# EAGLE design rgbw-driver (EAGLE 6.5.0)
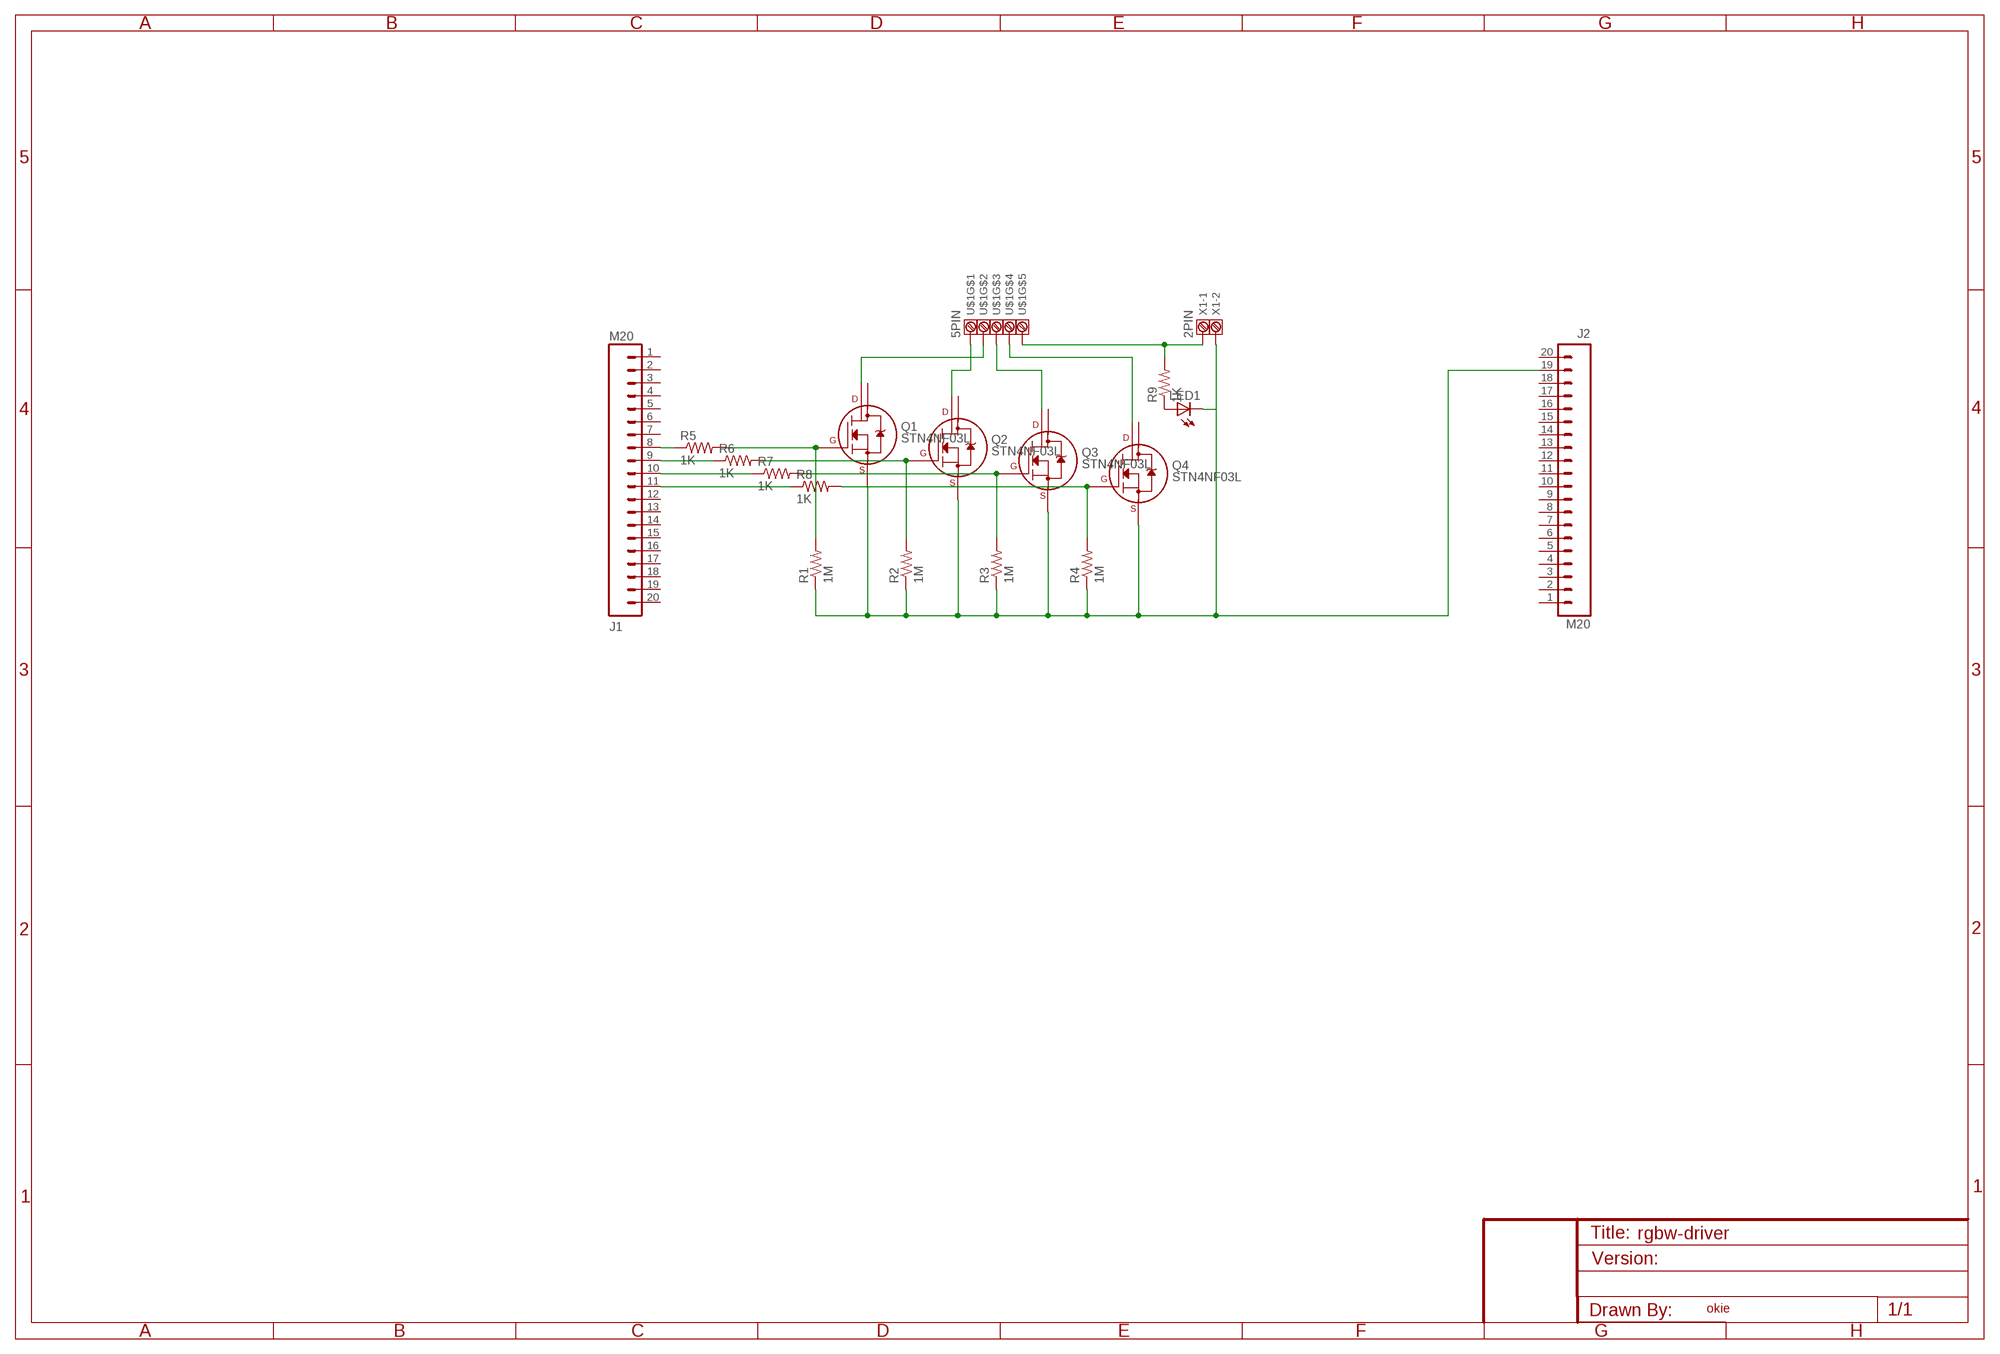
[diagram p0: schematic, sheet 1]

## Parts
J1  M20  [1X20]
J2  M20  [1X20]
LED1  LEDCHIP-LED0805  [CHIP-LED0805]
Q1  STN4NF03L  IRLL014  [SOT-223]
Q2  STN4NF03L  IRLL014  [SOT-223]
Q3  STN4NF03L  IRLL014  [SOT-223]
Q4  STN4NF03L  IRLL014  [SOT-223]
R1  1M  R-US_R0805  [R0805]
R2  1M  R-US_R0805  [R0805]
R3  1M  R-US_R0805  [R0805]
R4  1M  R-US_R0805  [R0805]
R5  1K  R-US_R0805  [R0805]
R6  1K  R-US_R0805  [R0805]
R7  1K  R-US_R0805  [R0805]
R8  1K  R-US_R0805  [R0805]
R9  1K  R-US_R0805  [R0805]
U$1  5PIN  [5PIN]
X1  2PIN  [2PIN]

## Nets
B: Q1.4(D2) U$1.2
G: U$1.4
N$1: J1.8 R5.1
N$2: Q1.1(G) R1.2 R5.2
N$3: LED1.A R9.1
N$4: J2.19 LED1.C Q1.3(S) Q2.3(S) Q3.3(S) Q4.3(S) R1.1 R2.1 R3.1 R4.1 X1.2
N$5: Q4.1(G) R4.2 R8.2
N$6: R9.2 U$1.5 X1.1
N$8: J1.9 R6.1
N$9: J1.10 R7.1
N$10: J1.11 R8.1
N$11: Q2.1(G) R2.2 R6.2
N$12: Q3.1(G) R3.2 R7.2
R: Q3.4(D2) U$1.3
W: Q2.4(D2) U$1.1
Unconnected: J1.1 J1.2 J1.3 J1.4 J1.5 J1.6 J1.7 J1.12 J1.13 J1.14 J1.15 J1.16 J1.17 J1.18 J1.19 J1.20 J2.1 J2.2 J2.3 J2.4 J2.5 J2.6 J2.7 J2.8 J2.9 J2.10 J2.11 J2.12 J2.13 J2.14 J2.15 J2.16 J2.17 J2.18 J2.20 Q1.2(D1) Q2.2(D1) Q3.2(D1) Q4.2(D1) Q4.4(D2)

## Notes on the sheet
- okie

## Library data of the parts
J1 J2 = SparkFun3:M20: This is just like the LOCK variant in that the holes are staggared by 5 mil, but except for the last two holes. They are not altered from the "standard" footprint layout. This is used for a special purpose on the layout of our Graphic LCD Backpack. Make sure you want to use this device before selecting it for you project!
LED1 = adafruit:LED: LED OSRAM: - CHIPLED LG R971, LG N971, LY N971, LG Q971, LY Q971, LO R971, LY R971 LH N974, LH R974 LS Q976, LO Q976, LY Q976 LO Q996 - Hyper CHIPLED LW Q18S LB Q993, LB Q99A, LB R99A - SideLED LS A670, LO A670, LY A670, LG A670, LP A670 LB A673, LV A673, LT A673, LW A673 LH A674 LY A675 LS A676, LA A676, LO A676, LY A676, LW A676 LS A679, LY A679, LG A679 - Hyper Micro SIDELED® LS Y876, LA Y876, LO Y876, LY Y876 LT Y87S - SmartLED LW L88C, LW L88S LB L89C, LB L89S, LG L890 LS L89K, LO L89K, LY L89K LS L896, LA L896, LO L896, LY L896 - TOPLED LS T670, LO T670, LY T670, LG T670, LP T670 LSG T670, LSP T670, LSY T670, LOP T670, LYG T670 LG T671, LOG T671, LSG T671 LB T673, LV T673, LT T673, LW T673 LH T674 LS T676, LA T676, LO T676, LY T676, LB T676, LH T676, LSB T676, LW T676 LB T67C, LV T67C, LT T67C, LS T67K, LO T67K, LY T67K, LW E67C LS E67B, LA E67B, LO E67B, LY E67B, LB E67C, LV E67C, LT E67C LW T67C LS T679, LY T679, LG T679 LS T770, LO T770, LY T770, LG T770, LP T770 LB T773, LV T773, LT T773, LW T773 LH T774 LS E675, LA E675, LY E675, LS T675 LS T776, LA T776, LO T776, LY T776, LB T776 LHGB T686 LT T68C, LB T68C - Hyper Mini TOPLED® LB M676 - Mini TOPLED Santana® LG M470 LS M47K, LO M47K, LY M47K Source: http://www.osram.convergy.de/
Q1-Q4 = transistors:IRLL*: International Rectifier IRLL series N-channel enhancement mode MOSFET HEXFET Power MOSFET SOT-223 Includes body diode
R1-R8 = resistor:R-US_: RESISTOR, American symbol
R9 = rcl:R-US_: RESISTOR, American symbol
U$1 = con-3.81:5PIN
X1 = con-3.81:2PIN: MKDS 1/4-3,81 Source: http://eshop.phoenixcontact.de; MF: FARNELL; MPN: 1727036; OC_FARNELL: 3704592; OC_NEWARK: 71C4114

## Net classes
1 vcc: width 0.254 mm

## Board
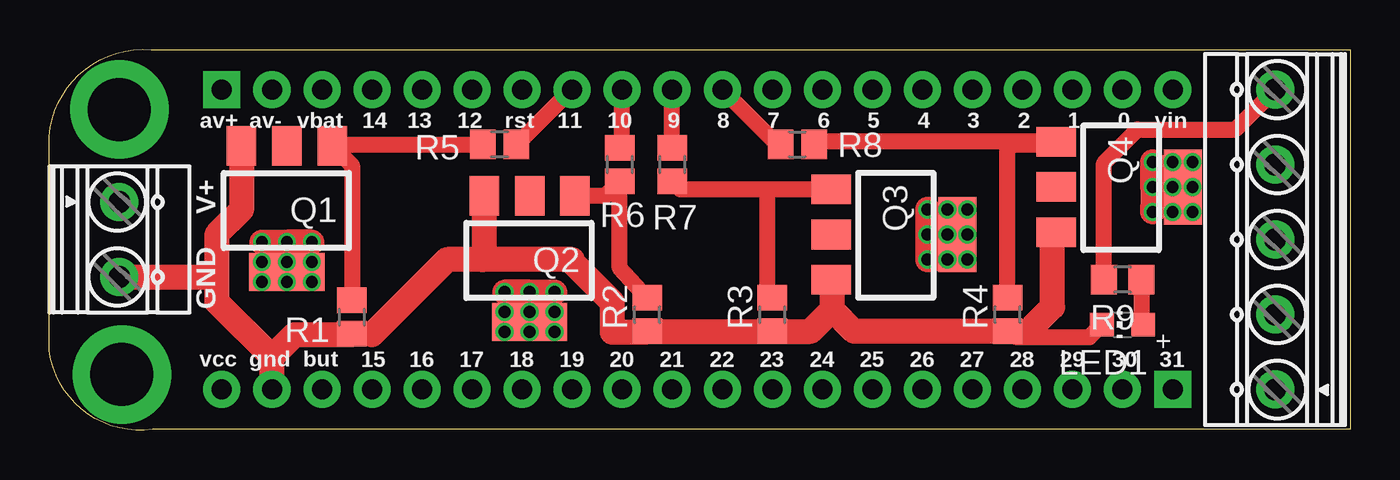
[diagram p1: board, top side]
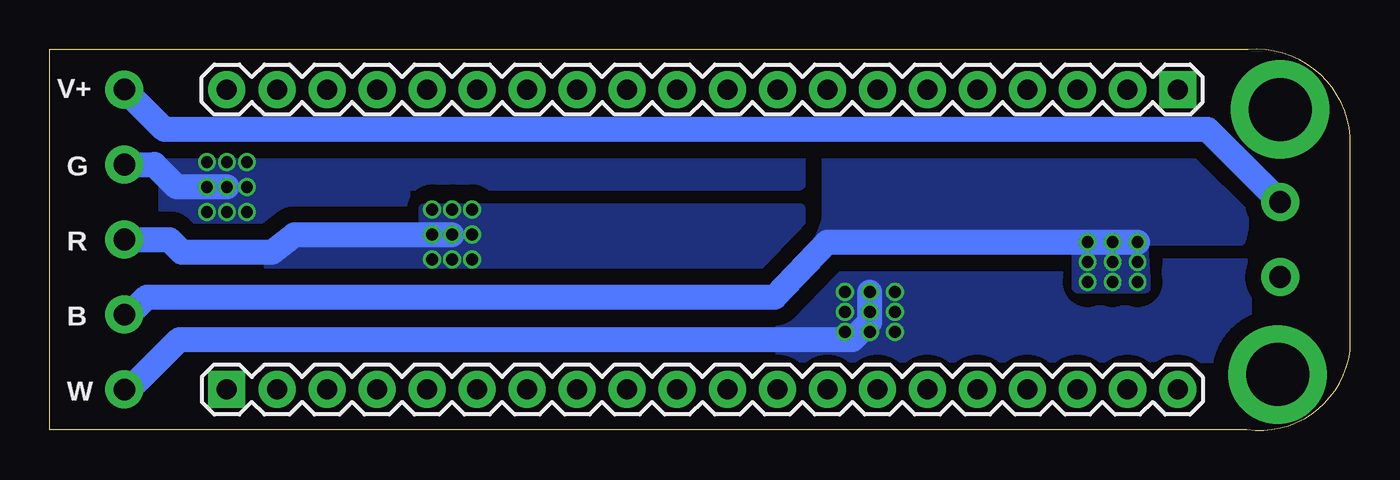
[diagram p2: board, bottom side, seen from below]

Size 66.04 x 19.36 mm. Coordinates in mm from the lower left corner, seen from the top.
Outline: 5.26,0.04 arc-90 0,4.03 0,14.93 arc-90 5.18,19.34 66.04,19.34 66.04,0.04 5.26,0.04
Copper layers (1*16): Top 0.035mm / dielectric 1.5mm / Bottom 0.035mm
Design rules "default *": minimum track width 6mil, minimum drill 15mil, track to track 6mil, track to pad 6mil, pad to pad 6mil, via to via 6mil, smd to smd 6mil, copper to edge 12mil, drill to drill 15mil, minimum pad ring 6mil, minimum via ring 6mil, stop-mask expansion 0mil, vias tented up to drill 15mil, thermal gap 8mil

### Footprints (pad centres in the part's own frame; a part is rotated, then mirrored left to right if it is on the bottom)
1X20 = drill 1.016 pad 1.88 square: 1 0,0 | drill 1.016 pad 1.88: 2 2.54,0; 3 5.08,0; 4 7.62,0; 5 10.16,0; 6 12.7,0; 7 15.24,0; 8 17.78,0; 9 20.32,0; 10 22.86,0; 11 25.4,0; 12 27.94,0; 13 30.48,0; 14 33.02,0; 15 35.56,0; 16 38.1,0; 17 40.64,0; 18 43.18,0; 19 45.72,0; 20 48.26,0
CHIP-LED0805 = smd 1.2 x 1.2: A 0,-1.05; C 0,1.05
SOT-223 = smd 1.499 x 2.007: 1 -2.3,-3.235; 2 0,-3.235; 3 2.3,-3.235 | smd 3.81 x 1.93: 4 0,3.175
R0805 = smd 1.3 x 1.5: 1 -0.85,0; 2 0.85,0
R0805' = smd 1.3 x 1.5: 1 -0.95,0; 2 0.95,0
5PIN = drill 1.1 pad 1.93: 1 -5.715,0; 2 -1.905,0; 3 1.905,0; 4 5.715,0; 5 9.525,0
2PIN = drill 1.1 pad 1.93: 1 -5.715,0; 2 -1.905,0

### Placement (x,y rotation side)
J1  8.76,17.31 180 bottom
J2  57.02,2.07 0 bottom
LED1  54.48,5.37 90 top
Q1  12.06,11.21 180 top
Q2  24.38,8.67 180 top
Q3  42.93,9.94 270 top
Q4  54.36,12.36 270 top
R1  15.37,5.75 90 top
R2  30.35,5.88 90 top
R3  36.7,5.88 90 top
R4  48.64,5.88 90 top
R5  22.86,14.52 180 top
R6  28.96,13.5 270 top
R7  31.62,13.5 270 top
R8  37.97,14.52 0 top
R9  1K  [R0805']  54.48,7.66 180 top
U$1  62.23,7.79 90 top
X1  3.56,5.88 270 top

### Tracks (layer width: path | path; a pad name or v marks a point on that pad's centre or on a via)
B  (via drill 0.6)
  Top 1.27: v10.79,9.56 v12.06,9.56 | v13.33,9.56 v12.06,9.56 | v12.06,9.56 Q1.4
  Bottom 1.27: U$1.2 61.98,5.88 61.09,6.77 29.21,6.77 26.54,9.56 v10.79,9.56
  other vias: 12.06,7.53 13.33,7.53 10.79,7.53 10.79,8.55 12.06,8.55 13.33,8.55
  pour Bottom (isolate 0.813, no thermals): 5.59,9.69 5.21,11.47 8.76,14.14 26.54,14.14 26.54,10.71 26.92,9.69 13.84,9.69 13.84,7.28 10.41,7.28 10.54,9.69
G  (via drill 0.6)
  Top 1.27: v56.01,12.36 v56.01,13.63 v56.01,11.09 56.01,11.34 v57.02,12.36
  Bottom 1.27: U$1.4 60.71,13.5 59.56,12.36 v57.02,12.36
  other vias: 58.04,12.36 58.04,13.63 58.04,11.09 57.02,13.63 57.02,11.09
  pour Bottom (isolate 0.813, no thermals): 27.94,12.48 27.94,14.01 50.16,14.01 60.2,14.01 60.2,10.96 59.18,10.96 58.55,10.33 55.37,10.33 54.36,11.09 54.23,11.21 48.01,11.21 48.01,12.23 48.01,12.36 48.01,12.48
N$1
  Top 0.813: R5.1 26.5,17.31 J1.8
N$2
  Top 0.813: R1.2 15.37,13.45 Q1.1 14.43,14.52 R5.2
N$3
  Top 0.813: R9.1 55.43,5.4 LED1.A
N$4
  Top 0.813: 15.33,4.86 R1.1 15.41,4.86 16.38,4.86 | 22.08,8.79 21.97,8.67 | 39.75,7.58 Q3.3 | 50.93,9.86 Q4.3 | 26.54,8.67 26.54,8.55 | 30.27,4.99 R2.1 | R4.1 48.73,5.12 49.11,4.74 49.91,4.74 | 49.91,4.74 52.8,4.74 LED1.C | 49.91,5.25 49.91,4.74
  Top 1.27: J2.19 11.3,3.72 | 11.3,3.72 12.45,4.86 15.33,4.86 | Q1.3 9.76,11.2 8.51,9.94 8.51,7.53 | 8.51,7.53 8.51,6.52 11.3,3.72 | 26.54,8.67 21.97,8.67 20.19,8.67 16.38,4.86 | Q2.3 22.08,8.79 | 39.75,6.13 38.65,5.03 R3.1 R2.1 | 39.75,6.13 39.75,7.58 | R4.1 40.85,5.03 39.75,6.13 | 50.93,9.86 50.93,6.26 49.91,5.25 | 26.54,8.55 28.57,6.52 28.57,4.99 30.27,4.99 | X1.2 8.25,7.79 8.51,7.53
N$5
  Top 0.813: R4.2 48.64,14.52 50.98,14.52 Q4.1 38.96,14.66 R8.2
N$6
  Top 0.813: R9.2 53.53,13.57 55.24,15.28 60.2,15.28 U$1.5
  Bottom 1.27: X1.1 7.24,15.28 60.2,15.28 U$1.5
N$8
  Top 0.813: R6.1 29.08,14.48 J1.9
N$9
  Top 0.813: R7.1 J1.10
N$10
  Top 0.813: R8.1 36.96,14.52 J1.11
N$11
  Top 0.813: Q2.1 28.21,11.91 R6.2 28.96,8.25 R2.2
N$12
  Top 0.813: R7.2 32.03,12.24 36.45,12.24 | 36.45,12.24 Q3.1 | R3.2 36.45,6.98 36.45,12.24
N$35  (via drill 3.2 pad 5)
  other vias: 3.56,16.29
N$39  (via drill 3.2 pad 5)
  other vias: 3.68,2.83
R  (via drill 0.6)
  Top 1.27: v45.59,9.94 45.59,10.2 v44.58,11.21 v44.58,8.67 44.83,8.67 Q3.4
  Bottom 1.27: U$1.3 59.94,9.69 59.31,9.06 54.74,9.06 53.59,9.94 v45.59,9.94
  other vias: 44.58,9.94 45.59,8.67 46.61,8.67 46.61,11.21 45.59,11.21 46.61,9.94
  pour Bottom (isolate 0.813, no thermals): 27.94,10.58 27.94,11.21 46.99,11.21 46.99,10.07 53.21,10.07 55.63,7.79 29.84,7.91
W  (via drill 0.6)
  Top 1.27: v24.38,7.02 v23.11,7.02 v25.65,7.02 Q2.4
  Bottom 1.27: U$1.1 61.98,2.07 59.44,4.61 25.27,4.61 Q2.4 v24.38,7.02
  other vias: 23.11,4.99 24.38,4.99 25.65,4.99 24.38,6.01 23.11,6.01 25.65,6.01
  pour Bottom (isolate 0.813, no thermals): 26.04,8.55 5.21,8.55 5.21,3.59 28.96,3.59 28.96,5.5

### Text on the board
_tsilk: av+ | av- | vbat | 14 | 13 | 12 | rst | 11 | 10 | 9 | 8 | 7 | 6 | 5 | 4 | 3 | 2 | 1 | 0 | vin | V+ | GND | vcc | gnd | but | 15 | 16 | 17 | 18 | 19 | 20 | 21 | 22 | 23 | 24 | 25 | 26 | 27 | 28 | 29 | 30 | 31
_bsilk: V+ | G | R | B | W